# EAGLE schematic twip-mb3 (EAGLE 9.3.0)
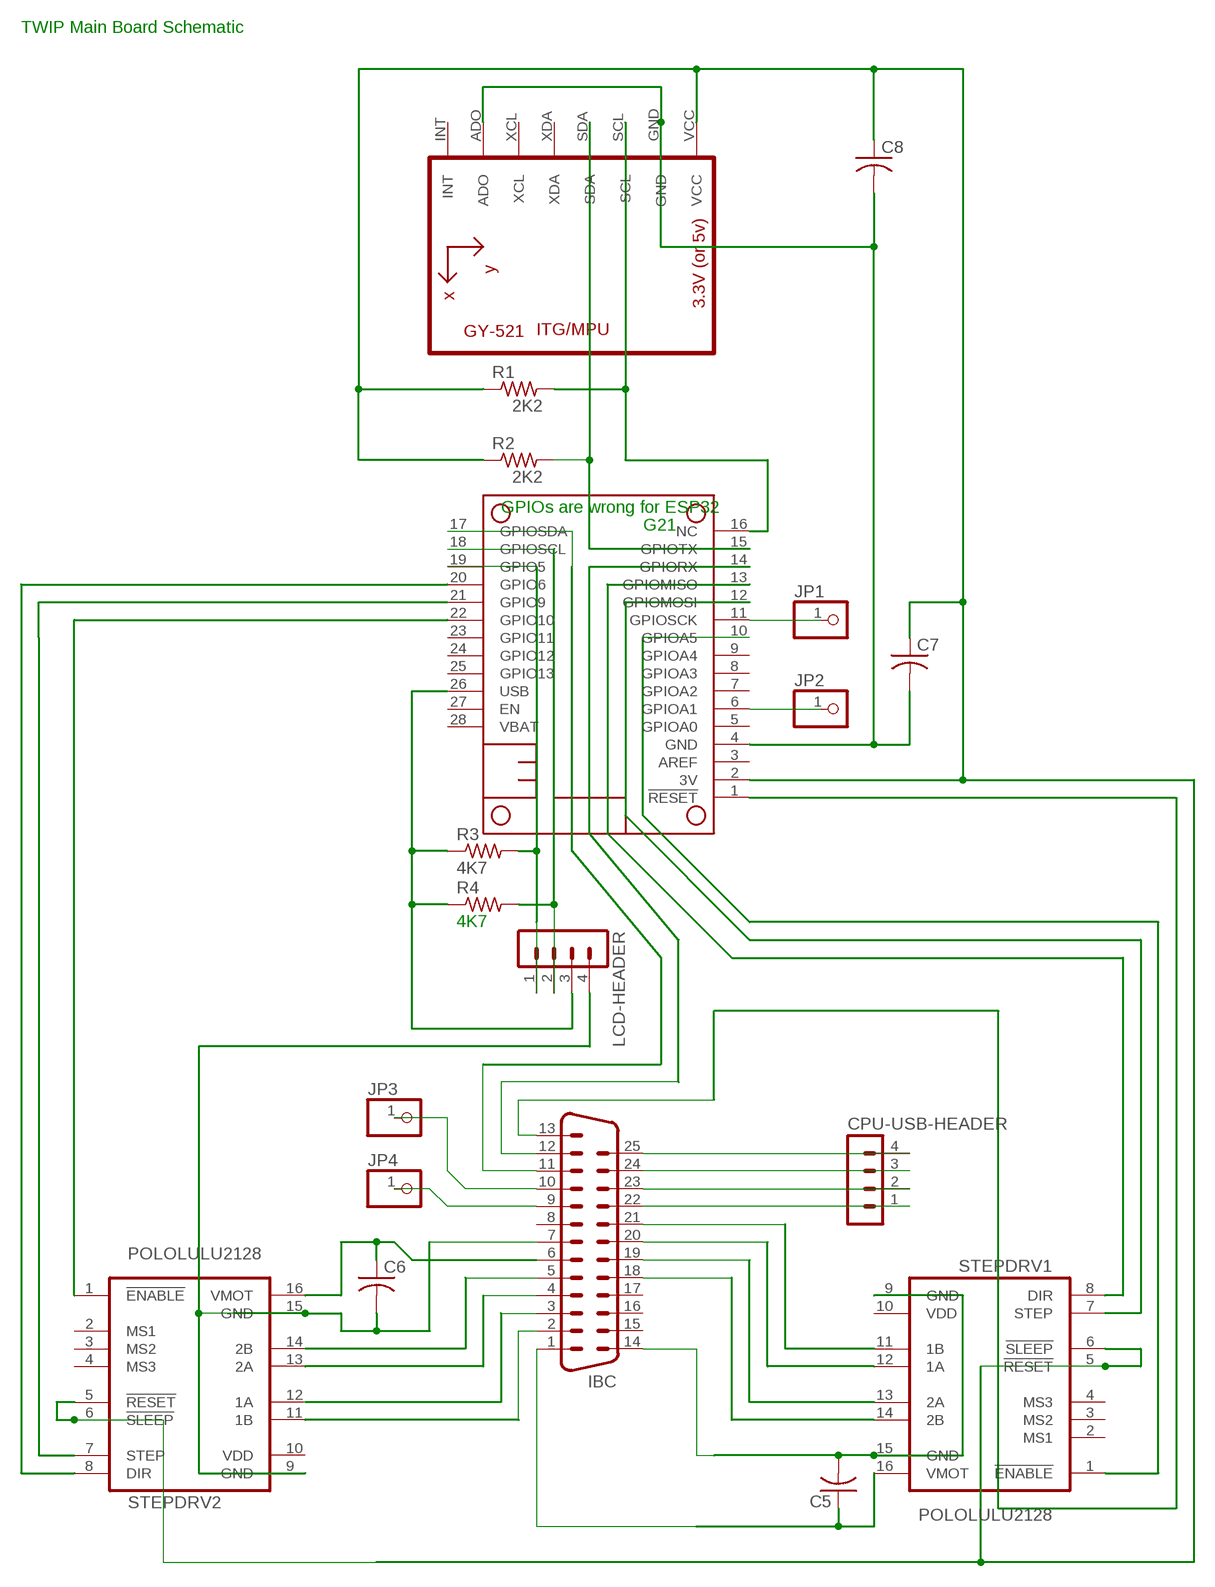
[diagram p0: schematic, sheet 1]

## Parts
C5  C-US050-024X044  [C050-024X044]
C6  C-US050-024X044  [C050-024X044]
C7  C-US050-024X044  [C050-024X044]
C8  C-US050-024X044  [C050-024X044]
CPU-USB-HEADER  MA04-1  [MA04-1]
IBC  M25VP  [M25VP]
JP1  PINHD-1X1  [1X01]
JP2  PINHD-1X1  [1X01]
JP3  PINHD-1X1  [1X01]
JP4  PINHD-1X1  [1X01]
LCD-HEADER  MA04-1  [MA04-1]
MS2  FEATHERWING_NOHOLES  [FEATHERWING_NOHOLES]
R1  2K2  R-US_0309/12  [0309/12]
R2  2K2  R-US_0309/12  [0309/12]
R3  4K7  R-US_0309/12  [0309/12]
R4  4K7  R-US_0309/12  [0309/12]
STEPDRV1  POLOLULU2128  [POLOLULU2128]
STEPDRV2  POLOLULU2128  [POLOLULU2128]
U1  GY-521MPU6050  [GY-521]

## Nets
3V: C7.1 C8.1 MS2.2(3V) R1.1 R2.1 STEPDRV1.5(!RESET) STEPDRV1.6(!SLEEP) STEPDRV2.5(!RESET) STEPDRV2.6(!SLEEP) U1.VCC
N$2: C7.2 C8.2 MS2.4(GND) U1.ADO U1.GND
N$3: IBC.18 STEPDRV1.14(2B)
N$4: IBC.19 STEPDRV1.13(2A)
N$5: MS2.12(GPIOMOSI) STEPDRV1.7(STEP)
N$6: IBC.20 STEPDRV1.12(1A)
N$7: IBC.21 STEPDRV1.11(1B)
N$8: IBC.2 STEPDRV2.11(1B)
N$9: IBC.3 STEPDRV2.12(1A)
N$10: IBC.4 STEPDRV2.13(2A)
N$11: LCD-HEADER.1 MS2.19(GPIO5) R3.2
N$12: IBC.5 STEPDRV2.14(2B)
N$13: CPU-USB-HEADER.4 IBC.25
N$14: CPU-USB-HEADER.3 IBC.24
N$15: MS2.13(GPIOMISO) STEPDRV1.8(DIR)
N$16: IBC.13 MS2.1(!RESET)
N$17: MS2.16(NC) R1.2 U1.SCL
N$18: CPU-USB-HEADER.2 IBC.23
N$19: IBC.12 MS2.14(GPIORX)
N$20: C5.2 IBC.14 STEPDRV1.9(GND) STEPDRV1.15(GND)
N$21: C6.1 IBC.6 STEPDRV2.16(VMOT)
N$22: C5.1 IBC.1 STEPDRV1.16(VMOT)
N$25: MS2.15(GPIOTX) R2.2 U1.SDA
N$27: MS2.20(GPIO6) STEPDRV2.8(DIR)
N$28: IBC.11 MS2.17(GPIOSDA)
N$29: MS2.21(GPIO9) STEPDRV2.7(STEP)
N$30: CPU-USB-HEADER.1 IBC.22
N$31: MS2.10(GPIOA5) STEPDRV1.1(!ENABLE)
N$32: JP1.1 MS2.11(GPIOSCK)
N$33: C6.2 IBC.7 LCD-HEADER.4 STEPDRV2.9(GND) STEPDRV2.15(GND)
N$34: MS2.22(GPIO10) STEPDRV2.1(!ENABLE)
N$35: LCD-HEADER.2 MS2.18(GPIOSCL) R4.2
N$36: JP2.1 MS2.6(GPIOA1)
N$37: IBC.10 JP3.1
N$38: IBC.9 JP4.1
USB: LCD-HEADER.3 MS2.26(USB) R3.1 R4.1
Unconnected: IBC.8 IBC.15 IBC.16 IBC.17 IBC.G1 IBC.G2 MS2.3(AREF) MS2.5(GPIOA0) MS2.7(GPIOA2) MS2.8(GPIOA3) MS2.9(GPIOA4) MS2.23(GPIO11) MS2.24(GPIO12) MS2.25(GPIO13) MS2.27(EN) MS2.28(VBAT) STEPDRV1.2(MS1) STEPDRV1.3(MS2) STEPDRV1.4(MS3) STEPDRV2.2(MS1) STEPDRV2.3(MS2) STEPDRV2.4(MS3) U1.INT U1.XCL U1.XDA

## Notes on the sheet
- TWIP Main Board Schematic
- GPIOs are wrong for ESP32
- G21

## Power pins joined to a net without a drawn wire
VDD: STEPDRV1.10(VDD) STEPDRV2.10(VDD)

## Library data of the parts
C5-C8 = rcl:C-US: CAPACITOR, American symbol; SPICEPREFIX: C
CPU-USB-HEADER LCD-HEADER = con-lstb:MA04-1: PIN HEADER; OC_FARNELL: unknown; OC_NEWARK: unknown
IBC = con-subd:M25VP: SUB-D; OC_FARNELL: unknown; OC_NEWARK: unknown
JP1-JP4 = pinhead:PINHD-1X1: PIN HEADER
MS2 = microbuilder:FEATHERWING
R1-R4 = resistor:R-US_: RESISTOR, American symbol
STEPDRV1 STEPDRV2 = stepper_drivers_etc:POLOLULU2128
U1 = gy-521:GY-521